# EAGLE design beod (EAGLE 8.5.1)
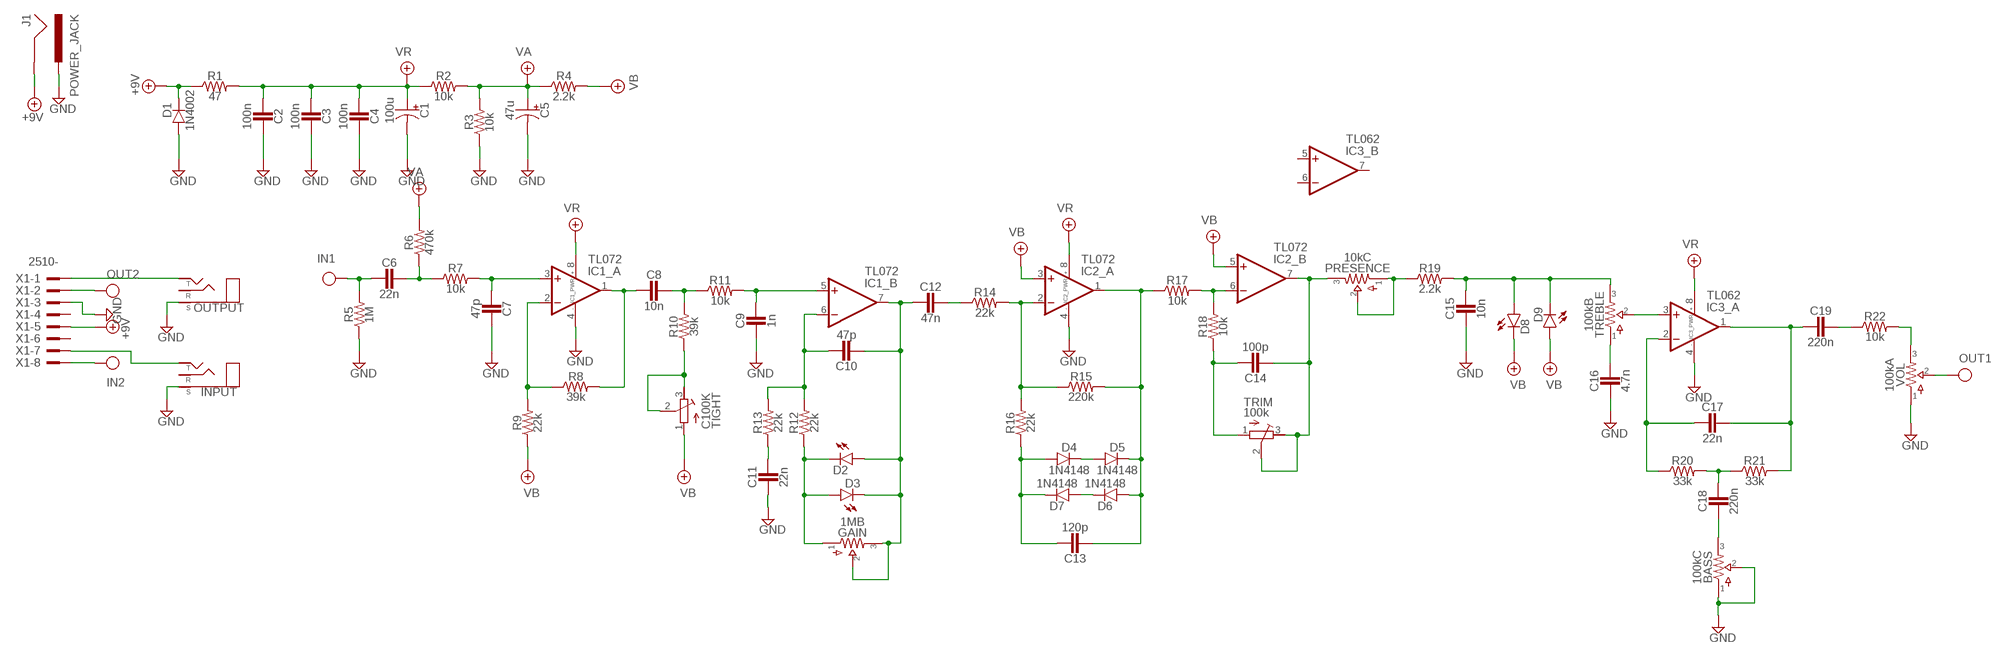
[diagram p0: schematic, sheet 1]

## Parts
BASS  100kC  POTS16MM  [16MM]
C1  100u  0400  [040_020]
C2  100n  CER/FILM2  [050X030_025_2]
C3  100n  CER/FILM2  [050X030_025_2]
C4  100n  CER/FILM2  [050X030_025_2]
C5  47u  0400  [040_020]
C6  22n  CER/FILMBOX.1  [BOX_SMALL]
C7  47p  CER/FILM2  [050X030_025_2]
C8  10n  CER/FILMBOX.1  [BOX_SMALL]
C9  1n  CER/FILMBOX.1  [BOX_SMALL]
C10  47p  CER/FILM2  [050X030_025_2]
C11  22n  CER/FILMBOX.1  [BOX_SMALL]
C12  47n  CER/FILMBOX.1  [BOX_SMALL]
C13  120p  CER/FILM2  [050X030_025_2]
C14  100p  CER/FILM2  [050X030_025_2]
C15  10n  CER/FILMBOX.1  [BOX_SMALL]
C16  4.7n  CER/FILMBOX.1  [BOX_SMALL]
C17  22n  CER/FILMBOX.1  [BOX_SMALL]
C18  220n  CER/FILMBOX.1  [BOX_SMALL]
C19  220n  CER/FILMBOX.1  [BOX_SMALL]
D1  1N4002  DO41.2  [DO41-2]
D2  3mm_RED  LED  [3MM_D]
D3  3mm_RED  LED  [3MM_D]
D4  1N4148  DO35.2  [DO35-2]
D5  1N4148  DO35.2  [DO35-2]
D6  1N4148  DO35.2  [DO35-2]
D7  1N4148  DO35.2  [DO35-2]
D8  3mm_RED  LED  [3MM_D]
D9  3mm_RED  LED  [3MM_D]
GAIN  1MB  POTS16MM  [16MM]
IC1  TL072  DUALTH  [DIL0]
IC2  TL072  DUALTH  [DIL0]
IC3  TL062  DUALTH  [DIL0]
INPUT  STEREONMJ  [NMJ6HCD2]
J1  POWER_JACK  [POWER_JACK_PTH]
OUTPUT  STEREONMJ  [NMJ6HCD2]
PRESENCE  10kC  POTS16MM  [16MM]
R1  47  R_.3B  [R0207/3]
R2  10k  R_.3B  [R0207/3]
R3  10k  R_.3B  [R0207/3]
R4  2.2k  R_.3B  [R0207/3]
R5  1M  R_.3B  [R0207/3]
R6  470k  R_.3B  [R0207/3]
R7  10k  R_.3B  [R0207/3]
R8  39k  R_.3B  [R0207/3]
R9  22k  R_.3B  [R0207/3]
R10  39k  R_.3B  [R0207/3]
R11  10k  R_.3B  [R0207/3]
R12  22k  R_.3B  [R0207/3]
R13  22k  R_.3B  [R0207/3]
R14  22k  R_.3B  [R0207/3]
R15  220k  R_.3B  [R0207/3]
R16  22k  R_.3B  [R0207/3]
R17  10k  R_.3B  [R0207/3]
R18  10k  R_.3B  [R0207/3]
R19  2.2k  R_.3B  [R0207/3]
R20  33k  R_.3B  [R0207/3]
R21  33k  R_.3B  [R0207/3]
R22  10k  R_.3B  [R0207/3]
TIGHT  C100K  R-TRIMM3296W  [RTRIM3296W]
TREBLE  100kB  POTS16MM  [16MM]
TRIM  100k  R-TRIMM3296W  [RTRIM3296W]
VOL  100kA  POTS16MM  [16MM]
X1  2510-  [PAK100/2500-10]

## Nets
+18V: D1.C J1.GND R1.1 X1.5 ; supply symbol labelled +9V
GND: BASS.1 BASS.2 C1.- C2.1 C3.1 C4.1 C5.- C7.1 C9.2 C11.2 C15.2 C16.2 D1.A IC1.4(_PWR:V-) IC2.4(_PWR:V-) IC3.4(_PWR:V-) INPUT.S J1.PWR OUTPUT.S R3.1 R5.1 VOL.1 X1.3
IN: C6.2 R5.2 X1.8
N$1: INPUT.T X1.7
N$2: C6.1 R6.1 R7.1
N$3: C7.2 IC1.3(_A:+IN) R7.2
N$4: OUTPUT.T X1.1
N$5: C8.2 IC1.1(_A:OUT) R8.2
N$6: IC1.2(_A:-IN) R8.1 R9.2
N$7: R10.1 TIGHT.2(S) TIGHT.3(E)
N$8: C8.1 R10.2 R11.1
N$9: C9.1 IC1.5(_B:+IN) R11.2
N$10: C10.1 IC1.6(_B:-IN) R12.2 R13.2
N$11: C10.2 C12.2 D2.ANODE(A) D3.P$1(C) GAIN.2 GAIN.3 IC1.7(_B:OUT)
N$12: C14.1 R18.1 TRIM.1(A)
N$13: C11.1 R13.1
N$14: D2.P$1(C) D3.ANODE(A) GAIN.1 R12.1
N$15: C14.2 IC2.7(_B:OUT) PRESENCE.3 TRIM.2(S) TRIM.3(E)
N$16: C12.1 R14.1
N$17: IC2.2(_A:-IN) R14.2 R15.1 R16.2
N$18: C13.1 D4.A D7.C R16.1
N$19: C13.2 D5.C D6.A IC2.1(_A:OUT) R15.2 R17.1
N$20: D4.C D5.A
N$21: D6.C D7.A
N$22: IC2.6(_B:-IN) R17.2 R18.2
N$23: C15.1 D8.ANODE(A) D9.P$1(C) R19.2 TREBLE.3
N$24: PRESENCE.1 PRESENCE.2 R19.1
N$25: C16.1 TREBLE.1
N$26: C17.2 IC3.2(_A:-IN) R20.1
N$27: C17.1 C19.2 IC3.1(_A:OUT) R21.2
N$28: C18.1 R20.2 R21.1
N$29: BASS.3 C18.2
N$30: IC3.3(_A:+IN) TREBLE.2
N$31: C19.1 R22.1
N$32: R22.2 VOL.3
OUT: VOL.2 X1.2
VA: C5.+ R2.2 R3.2 R4.1 R6.2
VB: D8.P$1(C) D9.ANODE(A) IC2.3(_A:+IN) IC2.5(_B:+IN) R4.2 R9.1 TIGHT.1(A)
VR: C1.+ C2.2 C3.2 C4.2 IC1.8(_PWR:V+) IC2.8(_PWR:V+) IC3.8(_PWR:V+) R1.2 R2.1
Unconnected: IC3.5(_B:+IN) IC3.6(_B:-IN) IC3.7(_B:OUT) INPUT.R OUTPUT.R X1.4 X1.6

## Library data of the parts
BASS GAIN PRESENCE TREBLE VOL = pedals-potentiometers:POTS
C1 C5 = pedals-capacitors-elec:040
C2-C4 C6-C19 = pedals-capacitors-film:CER/FILM: 47 - 120pF Xicon Ceramic Disc 2.5mm lead spacing
D1 = pedals-diodes:DO41: DO-41 Package Diodes: 1N4001 - 1N40019 Zener Diodes: 1N4728 - 1N4764
D2 D3 D8 D9 = pedals-diodes:LED
D4-D7 = pedals-diodes:DO35: DO-35 Package Diodes: 1N914
IC1-IC3 = pedals-integrated circuits:DUAL: OP AMP
INPUT OUTPUT = pedals-jacks:STEREO
J1 = pedals-jacks:POWER_JACK: Power Jack Connector This is the standard 5.5mm barrel jack for power. The PTH is the most common, proven, reliable, footprint. The Slot footprint only works if the mill layer is transmitted to the PCB fab house so be warned. Here are the connectors we sell at SparkFun: DC Barrel Power Jack/Connector <https://www.sparkfun.com/products/119> (PRT-00119) DC Barrel Power Jack/Connector (SMD) <https://www.sparkfun.com/products/12748> (PRT-12748) DC Barrel Jack Adapter - Breadboard Compatible <https://www.sparkfun.com/products/10811> (PRT-10811) It is used on this SparkFun product (and many, many others): SparkFun RedBoard - Programmed with Arduino <https://www.sparkfun.com/products/12757> (DEV-12757) Also, if you need a mating power supply or connector, please check these out: Wall Adapter Power Supply - 9VDC 650mA <https://www.sparkfun.com/products/298> (TOL-00298) DC Barrel Jack Adapter - Male <https://www.sparkfun.com/products/10287> (PRT-10287); PROD_ID: CONN-08197
R1-R22 = pedals-resistors:R_
TIGHT TRIM = pedals-potentiometers:R-TRIMM: Trimm resistor
X1 = pedals-headers:2510-: 3M (TM) Pak 100 4-Wall Header Source: 3M; MF: 3M; MPN: 2510-6002UB; OC_FARNELL: 9838244; OC_NEWARK: 46F4725

## Board
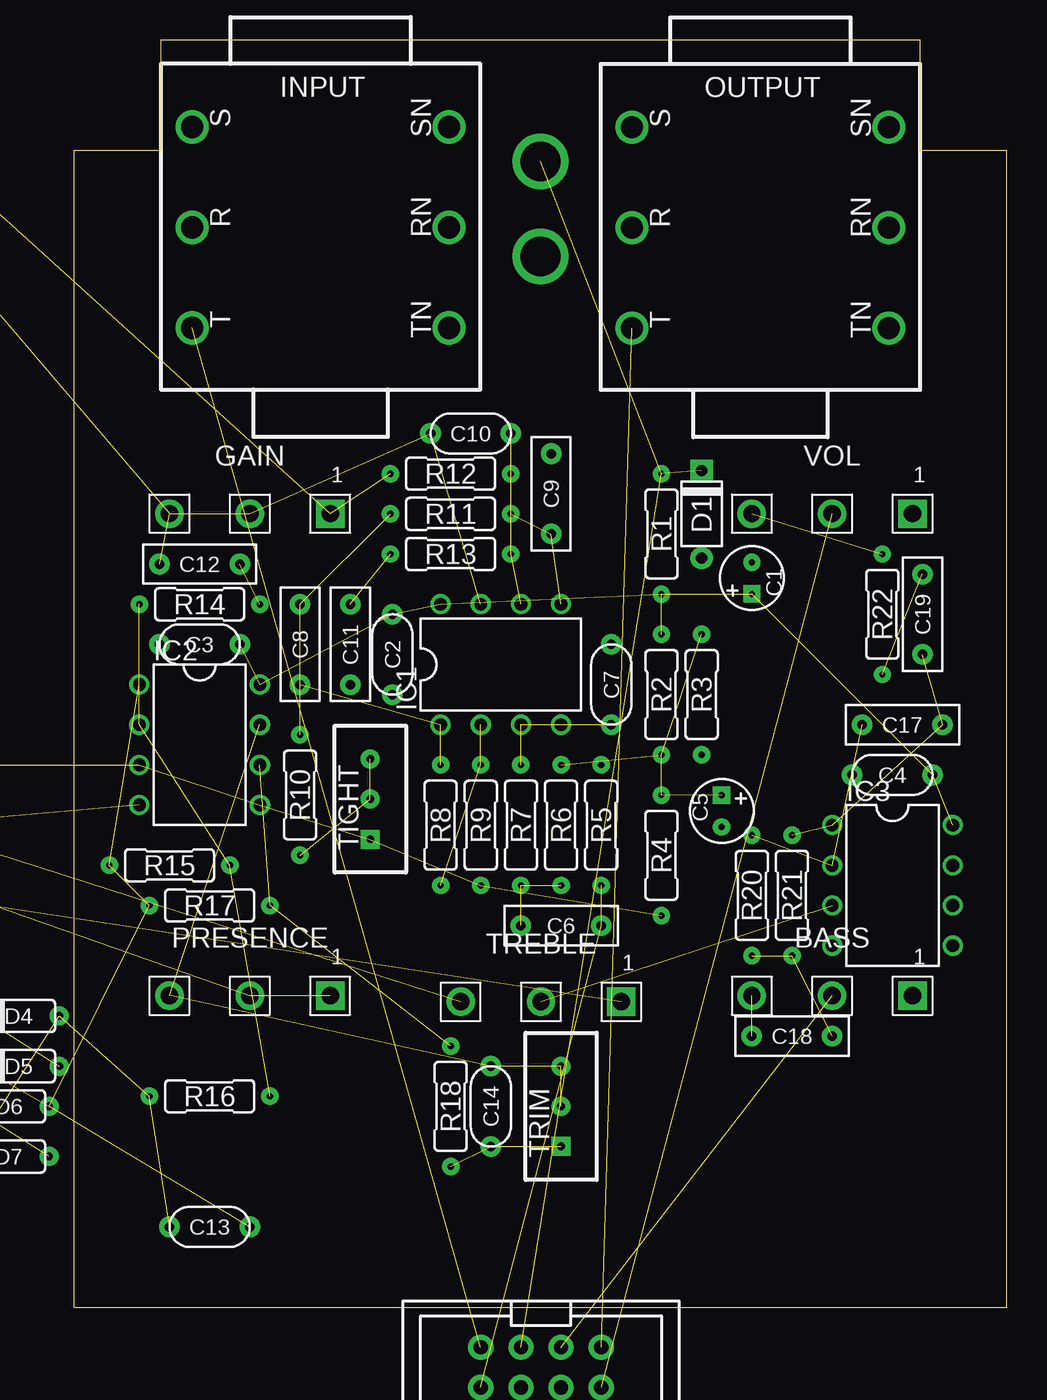
[diagram p1: board, top side]
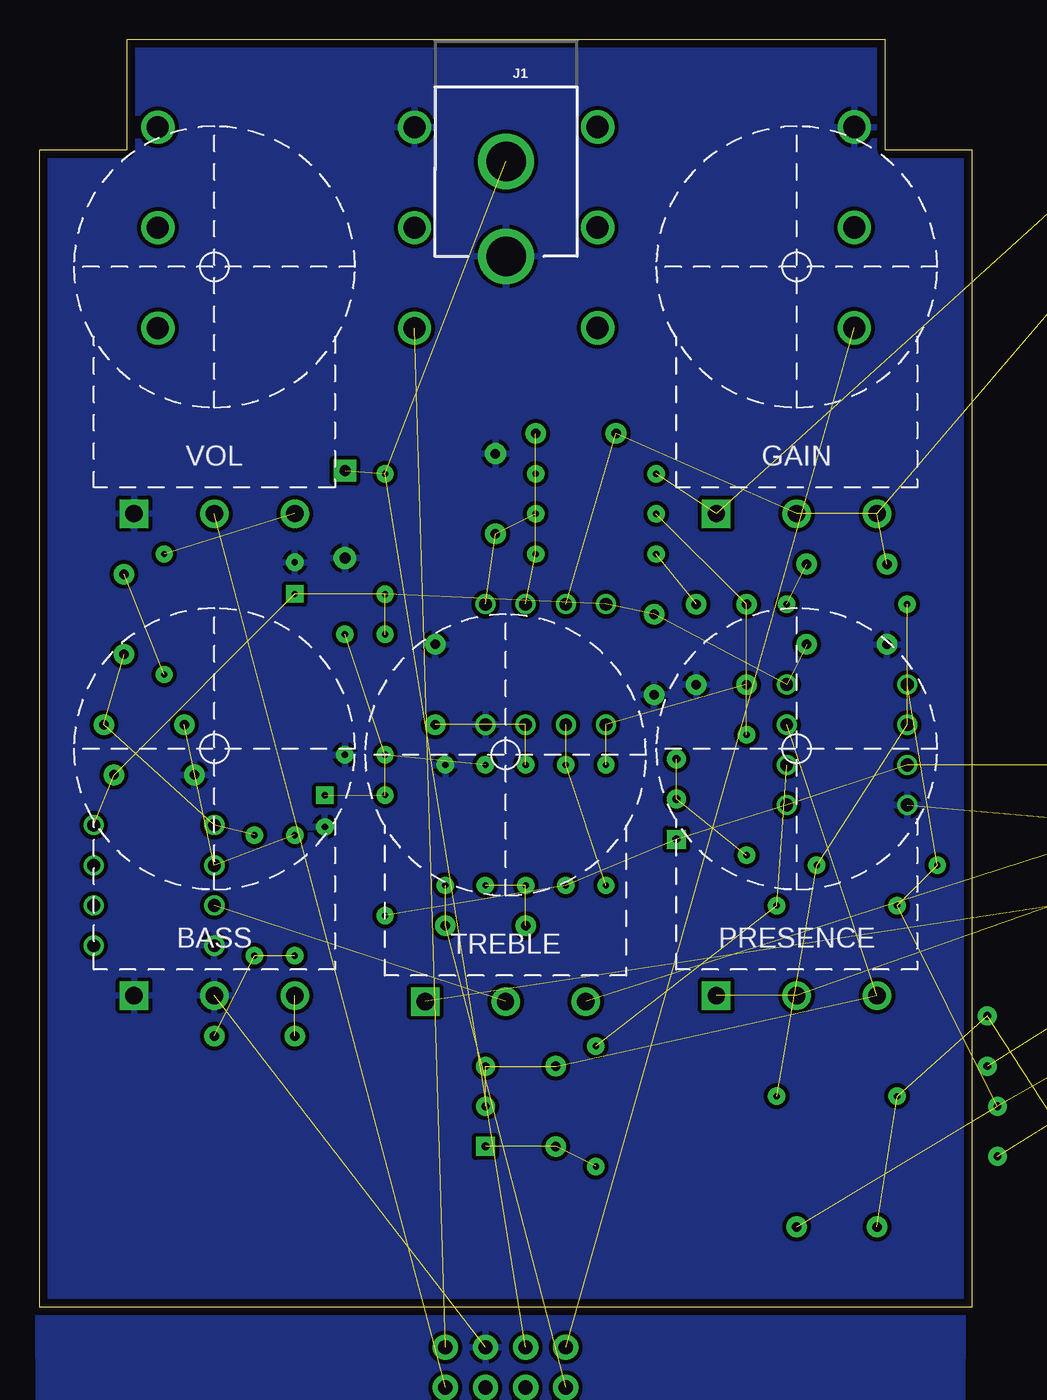
[diagram p2: board, bottom side, seen from below]

Size 59 x 80.16 mm. Coordinates in mm from the lower left corner, seen from the top.
Copper layers (1*16): Top 0.035mm / dielectric 1.6mm / Bottom 0.035mm
Design rules "Elecrow_2-layer_PCB_eagle_rule": minimum track width 6mil, minimum drill 12mil, track to track 6mil, track to pad 6mil, pad to pad 6mil, via to via 8mil, smd to smd 0mil, copper to edge 20mil, drill to drill 10mil, minimum pad ring 6mil, minimum via ring 6mil, stop-mask expansion 0mil, vias tented up to drill 100mil, thermal gap 10mil
tRestrict: 24 lines

### Footprints (pad centres in the part's own frame; a part is rotated, then mirrored left to right if it is on the bottom)
16MM = drill 1.1 pad 1.8 square: 1 5.08,-1 | drill 1.1 pad 1.8: 2 0,-1; 3 -5.08,-1
040_020 = drill 0.4 pad 1.1 square: + -1.001,0 | drill 0.4 pad 1.1: - 1.001,0
050X030_025_2 = drill 0.6 pad 1.3: 1 -2.54,0; 2 2.54,0
BOX_SMALL = drill 0.6 pad 1.3: 1 -2.54,0; 2 2.54,0
DO41-2 = drill 0.7 pad 1.4: A 2.794,0 | drill 0.7 pad 1.4 square: C -2.731,0
3MM_D = drill 0.8 pad 1.5 square: ANODE -1.27,0 | drill 0.8 pad 1.5: P$1 1.27,0
DO35-2 = drill 0.5 pad 1.2: A 2.54,0 | drill 0.5 pad 1.2 square: C -2.54,0
DIL0 = drill 0.813 pad 1.27: 1 -3.81,-3.81; 2 -1.27,-3.81; 3 1.27,-3.81; 4 3.81,-3.81; 5 3.81,3.81; 6 1.27,3.81; 7 -1.27,3.81; 8 -3.81,3.81
NMJ6HCD2 = drill 1.4: R 0,8.115; RN 0,-8.115; S 6.35,8.115; SN 6.35,-8.115; T -6.35,8.115; TN -6.35,-8.115
POWER_JACK_PTH = drill 2.5: GND 0,7.7; PWR 0,13.7
R0207/3 = drill 0.4 pad 1.1: 1 -3.81,0; 2 3.81,0
RTRIM3296W = drill 0.5 pad 1.2 square: 1 0,-2.54 | drill 0.5 pad 1.2: 2 0,0; 3 0,2.54
PAK100/2500-10 = drill 0.9 pad 1.6: 1 -3.81,-1.27; 2 -3.81,1.27; 3 -1.27,-1.27; 4 -1.27,1.27; 5 1.27,-1.27; 6 1.27,1.27; 7 3.81,-1.27; 8 3.81,1.27

### Placement (x,y rotation side)
BASS  47.94,20.7 0 top
C1  42.86,46.1 90 top
C2  20.13,41.27 90 top
C3  7.94,41.91 0 top
C4  51.75,33.66 0 top
C5  40.96,31.37 270 top
C6  30.8,24.13 0 top
C7  33.97,39.37 270 top
C8  14.29,41.91 270 top
C9  30.16,51.44 90 top
C10  25.08,55.25 180 top
C11  17.46,41.91 270 top
C12  7.94,46.99 180 top
C13  8.57,5.08 0 top
C14  26.35,12.7 90 top
C15  -29.53,32.39 0 top  (outside the outline)
C16  -27.62,29.21 0 top  (outside the outline)
C17  52.39,36.83 180 top
C18  45.4,17.14 180 top
C19  53.66,43.81 270 top
D1  39.69,50.17 270 top
D2  -18.73,80.64 0 top  (outside the outline)
D3  -23.81,80.64 0 top  (outside the outline)
D4  -3.49,18.41 0 top
D5  -3.49,15.24 0 top
D6  -4.13,12.7 0 top
D7  -4.13,9.53 0 top
D8  -35.88,34.29 0 top  (outside the outline)
D9  -40.96,34.29 0 top  (outside the outline)
GAIN  11.11,51.18 0 top
IC1  26.99,40.64 0 top
IC2  7.94,35.56 270 top
IC3  51.75,26.67 270 top
INPUT  15.59,68.28 90 top
J1  29.5,80.16 180 bottom
OUTPUT  43.4,68.26 90 top
PRESENCE  11.11,20.7 0 top
R1  37.15,48.89 270 top
R2  37.15,38.73 270 top
R3  39.69,38.73 90 top
R4  37.15,28.57 270 top
R5  33.34,30.48 270 top
R6  30.8,30.48 90 top
R7  28.26,30.48 90 top
R8  23.18,30.48 90 top
R9  25.72,30.48 90 top
R10  14.29,32.39 90 top
R11  23.81,50.17 0 top
R12  23.81,52.7 0 top
R13  23.81,47.62 0 top
R14  7.94,44.45 180 top
R15  6.03,27.94 180 top
R16  8.57,13.34 0 top
R17  8.57,25.4 0 top
R18  23.81,12.7 90 top
R19  -28.26,34.92 0 top  (outside the outline)
R20  42.86,26.04 270 top
R21  45.4,26.04 90 top
R22  51.12,43.81 90 top
TIGHT  18.73,32.13 0 top
TREBLE  29.53,20.32 0 top
TRIM  30.8,12.7 0 top
U$2  [125B_PCB_HUGE]  0,-7.62 0 top  (outside the outline)
VOL  47.94,51.18 0 top
X1  29.53,-3.81 180 top

### Tracks (layer width: path | path; a pad name or v marks a point on that pad's centre or on a via)
+18V  (3 unrouted)
GND  (3 unrouted)
  pour Bottom (isolate 0.254): 0.32,80.01 59.37,80.01 59.05,-7.62 0.64,-7.62
IN  (2 unrouted)
N$1  (1 unrouted)
N$2  (2 unrouted)
N$3  (2 unrouted)
N$4  (1 unrouted)
N$5  (2 unrouted)
N$6  (2 unrouted)
N$7  (2 unrouted)
N$8  (2 unrouted)
N$9  (2 unrouted)
N$10  (3 unrouted)
N$11  (6 unrouted)
N$12  (2 unrouted)
N$13  (1 unrouted)
N$14  (3 unrouted)
N$15  (4 unrouted)
N$16  (1 unrouted)
N$17  (3 unrouted)
N$18  (3 unrouted)
N$19  (5 unrouted)
N$20  (1 unrouted)
N$21  (1 unrouted)
N$22  (2 unrouted)
N$23  (4 unrouted)
N$24  (2 unrouted)
N$25  (1 unrouted)
N$26  (2 unrouted)
N$27  (3 unrouted)
N$28  (2 unrouted)
N$29  (1 unrouted)
N$30  (1 unrouted)
N$31  (1 unrouted)
N$32  (1 unrouted)
OUT  (1 unrouted)
VA  (4 unrouted)
VB  (6 unrouted)
VR  (8 unrouted)